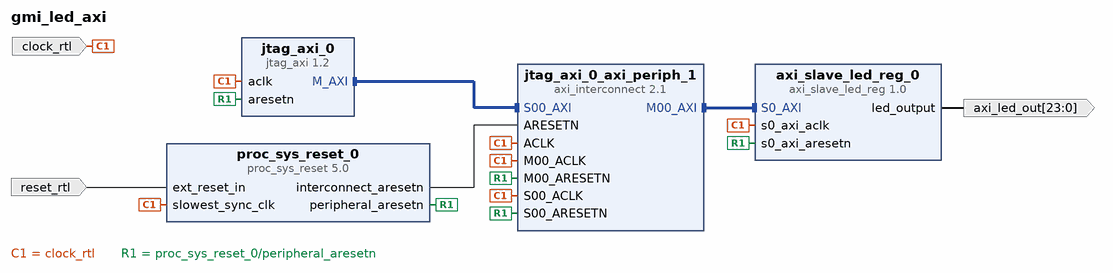
[diagram p0: block diagram of the top level]
# Vivado block design gmi_led_axi, xcvu9p-flga2577-2L-e-es1, Vivado 2016.4
create_bd_design gmi_led_axi

create_bd_port -dir I -type rst reset_rtl
set_property -dict {CONFIG.POLARITY ACTIVE_HIGH} [get_bd_ports reset_rtl]
create_bd_port -dir I -type clk clock_rtl
set_property -dict {CONFIG.FREQ_HZ 100000000 CONFIG.PHASE 0.000} [get_bd_ports clock_rtl]
create_bd_port -dir O -from 23 -to 0 axi_led_out

create_bd_cell -type ip -vlnv xilinx.com:ip:jtag_axi:1.2 jtag_axi_0
create_bd_cell -type ip -vlnv user.org:user:axi_slave_led_reg:1.0 axi_slave_led_reg_0
create_bd_cell -type ip -vlnv xilinx.com:ip:proc_sys_reset:5.0 proc_sys_reset_0
create_bd_cell -type ip -vlnv xilinx.com:ip:axi_interconnect:2.1 jtag_axi_0_axi_periph_1
set_property -dict {CONFIG.NUM_MI 1} [get_bd_cells jtag_axi_0_axi_periph_1]

# ---- connections ----

connect_bd_intf_net [get_bd_intf_pins jtag_axi_0/M_AXI] [get_bd_intf_pins jtag_axi_0_axi_periph_1/S00_AXI]
connect_bd_intf_net [get_bd_intf_pins jtag_axi_0_axi_periph_1/M00_AXI] [get_bd_intf_pins axi_slave_led_reg_0/S0_AXI]
connect_bd_net -net clk_wiz_clk_out1 [get_bd_ports clock_rtl] \
  [get_bd_pins jtag_axi_0/aclk] [get_bd_pins jtag_axi_0_axi_periph_1/S00_ACLK] \
  [get_bd_pins proc_sys_reset_0/slowest_sync_clk] [get_bd_pins jtag_axi_0_axi_periph_1/ACLK] \
  [get_bd_pins axi_slave_led_reg_0/s0_axi_aclk] [get_bd_pins jtag_axi_0_axi_periph_1/M00_ACLK]
connect_bd_net [get_bd_pins proc_sys_reset_0/peripheral_aresetn] \
  [get_bd_pins jtag_axi_0/aresetn] [get_bd_pins jtag_axi_0_axi_periph_1/S00_ARESETN] \
  [get_bd_pins axi_slave_led_reg_0/s0_axi_aresetn] [get_bd_pins jtag_axi_0_axi_periph_1/M00_ARESETN]
connect_bd_net [get_bd_pins proc_sys_reset_0/interconnect_aresetn] [get_bd_pins jtag_axi_0_axi_periph_1/ARESETN]
connect_bd_net [get_bd_ports reset_rtl] [get_bd_pins proc_sys_reset_0/ext_reset_in]
connect_bd_net [get_bd_pins axi_slave_led_reg_0/led_output] [get_bd_ports axi_led_out]

# ---- address map ----
assign_bd_address -offset 0x44A00000 -range 64K -target_address_space [get_bd_addr_spaces jtag_axi_0/Data] [get_bd_addr_segs axi_slave_led_reg_0/S0_AXI/S0_AXI_reg]

validate_bd_design
save_bd_design
